# EAGLE schematic yawc (EAGLE 6.6.0)
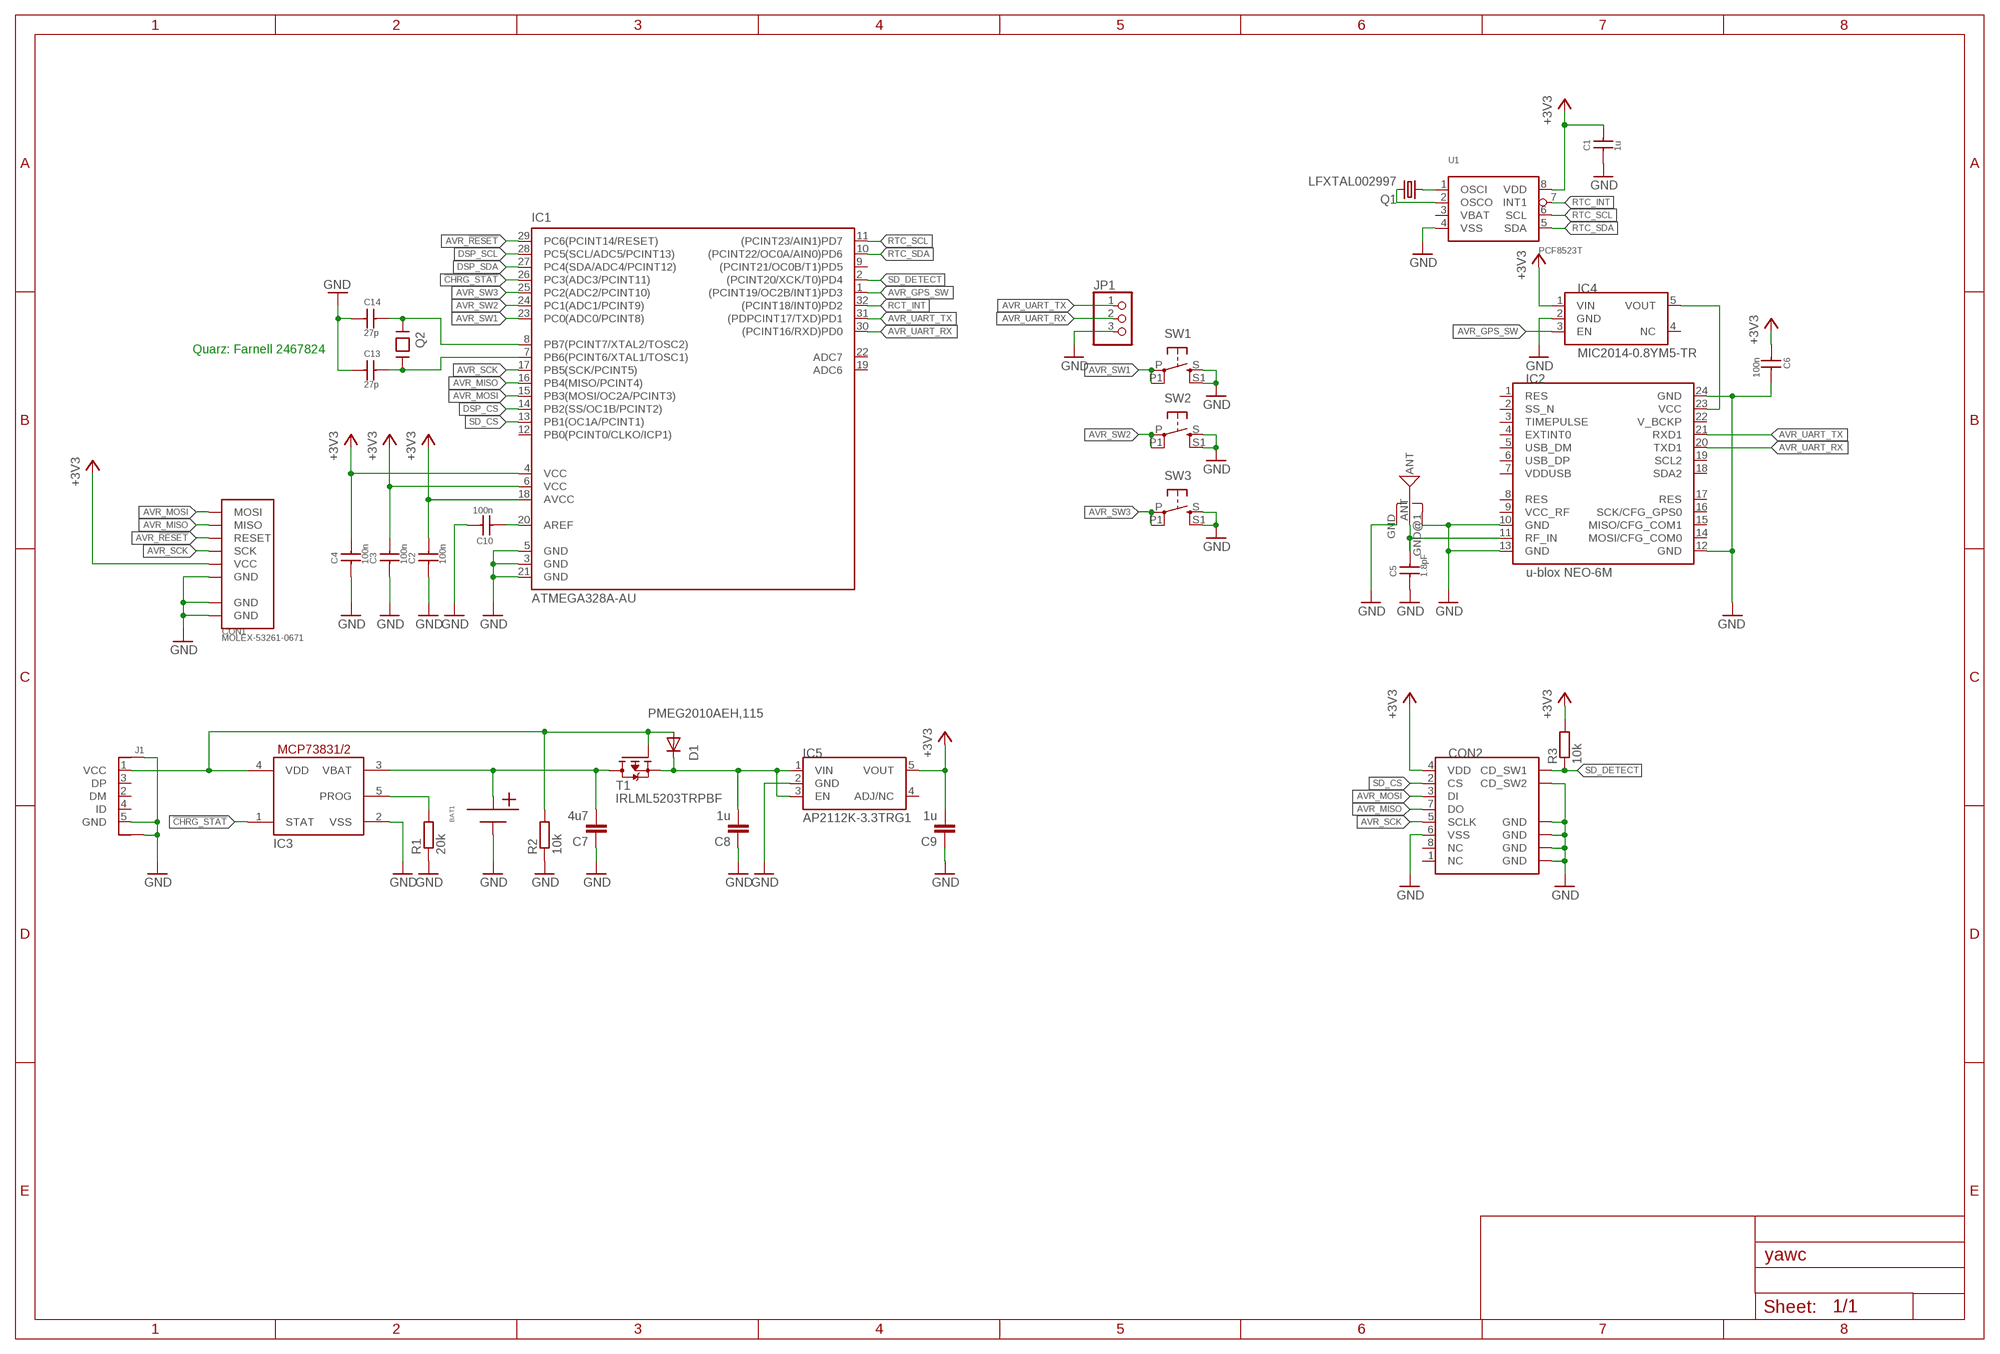
[diagram p0: schematic, sheet 1]

## Parts
BAT1  LIPO_1S  [LIPO_1S_SOLDER_CON]
C1  1u  C_SMD0603  [C0603]
C2  100n  C_SMD0603  [C0603]
C3  100n  C_SMD0603  [C0603]
C4  100n  C_SMD0603  [C0603]
C5  1.8pF  C_SMD0603  [C0603]
C6  100n  C_SMD0603  [C0603]
C7  4u7  C-EUC0805  [C0805]
C8  1u  C-EUC0805  [C0805]
C9  1u  C-EUC0805  [C0805]
C10  100n  C_SMD0603  [C0603]
C13  27p  C_SMD0603  [C0603]
C14  27p  C_SMD0603  [C0603]
CON1  MOLEX-53261-0671  [MOLEX-53261-0671]
CON2  MICRO_SD_1140084168  [MICRO_SD_1140084168]
D1  PMEG2010AEH,115  [SOD123]
IC1  ATMEGA328A-AU  ATMEGA48A-AU  [TQFP32]
IC2  u-blox NEO-6M  NEO-6M  [NEO-6]
IC3  MCP73831/OT  [SOT23-5L]
IC4  MIC2014-0.8YM5-TR  [SOT-23-5]
IC5  AP2112K-3.3TRG1  [SOT-23-5]
J1  XM7D-0512  [XM7D-0512]
JP1  PINHD-1X3  [1X03]
Q1  LFXTAL002997  CRYSTALTC26H  [TC26H]
Q2  16MHz  CRYSTAL-ABRACON-ABM7-SMD  [CRYSTAL-ABRACON-ABM7-SMD]
R1  20k  R-EU_R0603  [R0603]
R2  10k  R-EU_R0603  [R0603]
R3  10k  R-EU_R0603  [R0603]
SW1  ALPS_SKHHLNA010  [ALPS_SKHHLNA010]
SW2  ALPS_SKHHLNA010  [ALPS_SKHHLNA010]
SW3  ALPS_SKHHLNA010  [ALPS_SKHHLNA010]
T1  IRLML5203TRPBF  [SOT23]
U1  PCF8523T  [SOT96-1]
U$1  ANT_W3011PULSE_1575MHZ  [ANT4MMX4.25MM]

## Nets
!CHRG_STAT: IC1.26(PC3(ADC3/PCINT11)) IC3.1(STAT)
+3V3: C1.2 C2.2 C3.2 C4.2 C6.1 C9.2 CON1.5(VCC) CON2.4(VDD) IC1.4(VCC) IC1.6(VCC) IC1.18(AVCC) IC4.1(VIN) IC5.5(VOUT) R3.2 U1.8(VDD)
AVR_!RESET: CON1.3(RESET) IC1.29(PC6(PCINT14/RESET))
AVR_GPS_SW: IC1.1((PCINT19/OC2B/INT1)PD3) IC4.3(EN)
AVR_MISO: CON1.2(MISO) CON2.7(DO) IC1.16(PB4(MISO/PCINT4))
AVR_MOSI: CON1.1(MOSI) CON2.3(DI) IC1.15(PB3(MOSI/OC2A/PCINT3))
AVR_SCK: CON1.4(SCK) CON2.5(SCLK) IC1.17(PB5(SCK/PCINT5))
AVR_SW1: IC1.23(PC0(ADC0/PCINT8)) SW1.P SW1.P1
AVR_SW2: IC1.24(PC1(ADC1/PCINT9)) SW2.P SW2.P1
AVR_SW3: IC1.25(PC2(ADC2/PCINT10)) SW3.P SW3.P1
AVR_UART_RX: IC1.30((PCINT16/RXD)PD0) IC2.20(TXD1) JP1.2
AVR_UART_TX: IC1.31((PDPCINT17/TXD)PD1) IC2.21(RXD1) JP1.1
DSP_CS: IC1.14(PB2(SS/OC1B/PCINT2))
DSP_SCL: IC1.28(PC5(SCL/ADC5/PCINT13))
DSP_SDA: IC1.27(PC4(SDA/ADC4/PCINT12))
GND: BAT1.P$1(+) C1.1 C2.1 C3.1 C4.1 C5.1 C6.2 C7.1 C8.1 C9.1 C10.2 C13.1 C14.1 CON1.6(GND) CON1.GND@1(GND) CON1.GND@2(GND) CON2.6(VSS) CON2.CD@2(CD_SW2) CON2.GND@1(GND) CON2.GND@2(GND) CON2.GND@3(GND) CON2.GND@4(GND) IC1.3(GND) IC1.5(GND) IC1.21(GND) IC2.10(GND) IC2.12(GND) IC2.13(GND) IC2.24(GND) IC3.2(VSS) IC4.2(GND) IC5.2(GND) J1.5(GND) J1.P$8(GND) J1.P$9(GND) JP1.3 R1.1 R2.1 SW1.S SW1.S1 SW2.S SW2.S1 SW3.S SW3.S1 U1.4(VSS) U$1.GND U$1.GND@1(GND)
N$1: Q1.1 U1.1(OSCI)
N$2: Q1.2 U1.2(OSCO)
N$3: C5.2 IC2.11(RF_IN) U$1.ANT
N$5: C13.2 IC1.7(PB6(PCINT6/XTAL1/TOSC1)) Q2.P$2
N$6: C10.1 IC1.20(AREF)
N$7: C14.2 IC1.8(PB7(PCINT7/XTAL2/TOSC2)) Q2.P$1
N$8: IC2.23(VCC) IC4.5(VOUT)
N$9: IC3.5(PROG) R1.2
N$10: D1.A IC3.4(VDD) J1.1(VCC) R2.2 T1.1(G)
N$11: BAT1.P$2(-) C7.2 IC3.3(VBAT) T1.3(D)
N$12: C8.2 D1.C IC5.1(VIN) IC5.3(EN) T1.2(S)
RCT_INT: IC1.32((PCINT18/INT0)PD2)
RTC_INT: U1.7(INT1)
RTC_SCL: IC1.11((PCINT23/AIN1)PD7) U1.6(SCL)
RTC_SDA: IC1.10((PCINT22/OC0A/AIN0)PD6) U1.5(SDA)
SD_CS: CON2.2(CS) IC1.13(PB1(OC1A/PCINT1))
SD_DETECT: CON2.CD@1(CD_SW1) IC1.2((PCINT20/XCK/T0)PD4) R3.1
Unconnected: CON2.1(NC) CON2.8(NC) IC1.9((PCINT21/OC0B/T1)PD5) IC1.12(PB0(PCINT0/CLKO/ICP1)) IC1.19(ADC6) IC1.22(ADC7) IC2.1(RES) IC2.2(SS_N) IC2.3(TIMEPULSE) IC2.4(EXTINT0) IC2.5(USB_DM) IC2.6(USB_DP) IC2.7(VDDUSB) IC2.8(RES) IC2.9(VCC_RF) IC2.14(MOSI/CFG_COM0) IC2.15(MISO/CFG_COM1) IC2.16(SCK/CFG_GPS0) IC2.17(RES) IC2.18(SDA2) IC2.19(SCL2) IC2.22(V_BCKP) IC4.4(NC) IC5.4(ADJ/NC) J1.2(DM) J1.3(DP) J1.4(ID)

## Notes on the sheet
- Quarz: Farnell 2467824

## Power pins joined to a net without a drawn wire
VBAT: U1.3(VBAT)

## Library data of the parts
BAT1 = SchlegelArmin:LIPO_1S
C1-C6 C10 C13 C14 = SchlegelAr_Master:C_SMD: C SMD 0402, 0603, 0805, 1206 last modified: Armin Schlegel, 24.03.2014
C7-C9 = rcl:C-EU: CAPACITOR, European symbol
CON1 = SchlegelAr_Master:MOLEX-53261-0671: MOLEX-53261-0671 - Molex picoblade 53261-0671 6 pol last modified: Armin Schlegel, 28.04.2014 http://de.mouser.com/ProductDetail/Molex/53261-0671/?qs=%2Fha2pyFadujL8XqTNrjzA%2Fy0AZso5hx2IWE7X8dEAdsn1tpb%2FKahAA%3D%3D http://www.mouser.com/ds/2/276/0532610671_PCB_HEADERS-170915.pdf
CON2 = SchlegelArmin:MICRO_SD_1140084168: Speicherkartenverbinder Micro SD 8 Pin PCB Gold http://www.mouser.de/ProductDetail/Amphenol-Commercial-Products/1140084168/?qs=sGAEpiMZZMuJakaoiLiBph8FsDENMA%2fPYqiScc5bEa4%3d http://www.mouser.com/ds/2/18/11400841-283410.pdf
D1 = SchlegelAr_Master:PMEG2010AEH,115: PMEG2010AEH,115 - Schottky Dioden & Gleichrichter SCHOTTKY 20V 1A last modified: Armin Schlegel, 28.04.2014 http://de.mouser.com/ProductDetail/NXP/PMEG2010AEH115/?qs=%2fha2pyFaduiWO3i5eIlfQX5b6czgq6ZcEuwj9gg6H7bnLXBU7fglKg%3d%3d http://www.mouser.com/ds/2/302/PMEG2010AEH_PMEG2010AET-117849.pdf
IC1 = SchlegelAr_Master:ATMEGA48A-AU: ATMEGA48A-AU last modified: Armin Schlegel, 22.03.2014 http://de.mouser.com/ProductDetail/Atmel/ATMEGA48A-AU/?qs=sGAEpiMZZMvqv2n3s2xjse40PngS4U1xmCDanmh3raU%3D http://www.mouser.com/ds/2/36/doc8271-50296.pdf
IC2 = SchlegelArmin:NEO-6M: U-Blox: NEO-6M https://wiki.microduino.cc/images/a/ab/NEO-6_DataSheet_%28GPS.G6-HW-09005%29.pdf https://www.u-blox.com/sites/default/files/products/documents/LEA-NEO-MAX-6_HIM_(UBX-14054794).pdf
IC3 = adafruit:MCP73831: MCP73831/2 Miniature Single-Cell, Fully Integrated Li-Ion, Li-Polymer Charge Management Controllers. Nice and small simple lipoly charge controller, with adjustable current and status output (LED) http://www.ladyada.net/library/pcb/eaglelibrary.html
IC4 = SchlegelArmin:MIC2014-0.8YM5-TR: Leistungsschalter IC - Leistungsverteiler SOT-23-6 http://www.mouser.de/ProductDetail/Microchip-Technology-Micrel/MIC2014-08YM5-TR/?qs=sGAEpiMZZMuCmTIBzycWfNh9ZobahofcgMBRUkrjiLvXpL%252bLXLmq5w%3d%3d http://www.mouser.com/ds/2/268/mic20xx-778478.pdf
IC5 = SchlegelArmin:AP2112K-3.3TRG1: LDO Spannungs-Regulator 600mA CMOS LDO 50mA 3.3V 250mV http://www.mouser.de/ProductDetail/Diodes-Incorporated/AP2112K-33TRG1/?qs=x6A8l6qLYDDPYHosCdzh%2fA%3d%3d http://www.mouser.com/ds/2/115/AP2112-271550.pdf
J1 = NeilBetham:XM7D-0512
JP1 = pinhead:PINHD-1X3: PIN HEADER
Q1 = crystal:CRYSTAL: CRYSTAL; OC_FARNELL: unknown; OC_NEWARK: unknown
Q2 = crystal-abracon-abm3-smd:CRYSTAL-ABRACON-ABM7-SMD
R1-R3 = rcl:R-EU_: RESISTOR, European symbol
SW1-SW3 = SchlegelArmin:ALPS_SKHHLNA010: Sensorschalter 6.0x6.0x3.85mm 160gf Mouser-Teilenr.: 688-SKHHLN Hersteller-Teilenummer: SKHHLNA010 http://www.mouser.de/ProductDetail/ALPS/SKHHLNA010/?qs=sGAEpiMZZMtFyPk3yBMYYENa54VecnLawNl9dwFZpCQ%3d
T1 = SchlegelAr_Master:IRLML5203TRPBF: IRLML5203TRPBF - MOSFET MOSFT P-Ch -30V -3A 98mOhm 9.5nC Log Lvl last modified: Armin Schlegel, 28.04.2014 http://de.mouser.com/ProductDetail/International-Rectifier/IRLML5203TRPBF/?qs=sGAEpiMZZMshyDBzk1%2fWi5%252bqVgN3%252bWS8t7qb9msI9Rk%3d http://www.mouser.com/ds/2/200/irlml5203pbf-223113.pdf
U1 = nxp_60:PCF8523: The PCF8523 is a CMOS Real-Time Clock (RTC) and calendar optimized for low power consumption. Data is transferred serially via an I2C-bus with a maximum data rate of 1000 kbit/s. Alarm and timer functions are available with the possibility to generate a wake-up signal on an interrupt pin. An offset register allows fine-tuning of the clock. The PCF8523 has a backup battery switch-over circuit, which detects power failures and automatically switches to the battery supply when a power failure occurs. AAL Eindhoven MK
U$1 = SchlegelArmin:ANT_W3011PULSE_1575MHZ: Pulse W3011 GPS Ceramic Chip Antenna (1.575 GHz) http://www.pulseelectronics.com/download/2971/w3011pdf/pdf http://www.mouser.de/ProductDetail/Pulse/W3011/?qs=sGAEpiMZZMtVFuKNr6IGvgFZkYVVF8%252bq